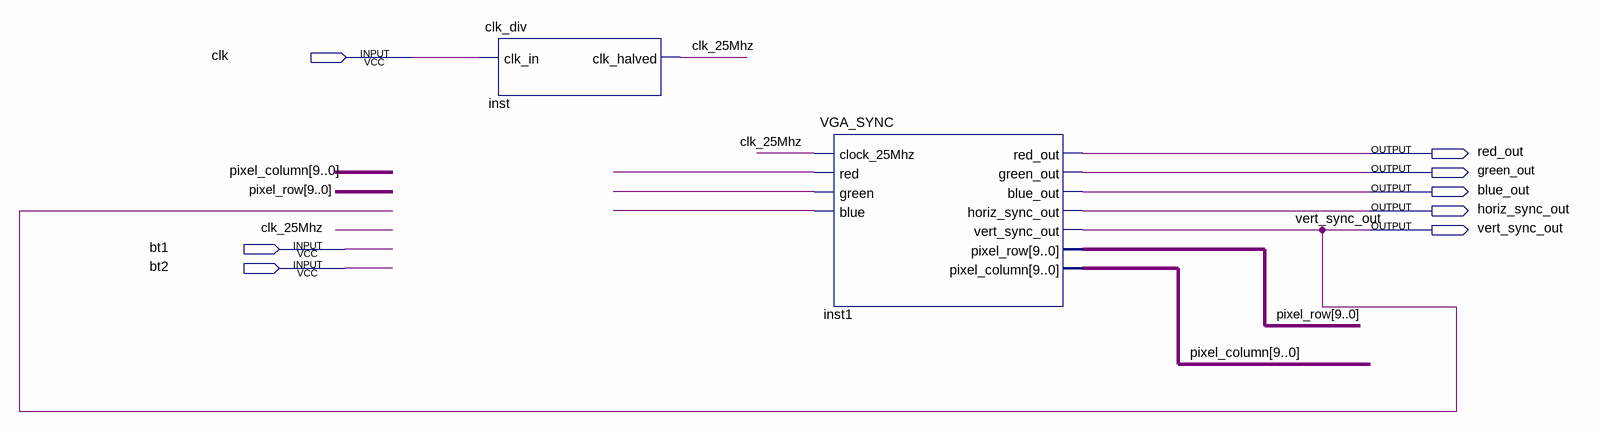
[diagram p0: schematic sheet]
// Quartus schematic Text.bdf as structural Verilog: 2 symbols, 8 pins
module Text (
  input  clk,
  input  bt1,
  input  bt2,
  output red_out,
  output green_out,
  output blue_out,
  output horiz_sync_out,
  output vert_sync_out
);

  wire clk_25Mhz, undriven, undriven_2, undriven_3;
  wire [9:0] pixel_column, pixel_row;

  clk_div inst (.clk_in(clk), .clk_halved(clk_25Mhz));
  VGA_SYNC inst1 (
    .clock_25Mhz(clk_25Mhz), .red(undriven), .green(undriven_2), .blue(undriven_3), .red_out(red_out),
    .green_out(green_out), .blue_out(blue_out), .horiz_sync_out(horiz_sync_out),
    .vert_sync_out(vert_sync_out), .pixel_row(pixel_row), .pixel_column(pixel_column));
endmodule
